# Altium schematic sheet LED Connectors.SchDoc
size A4
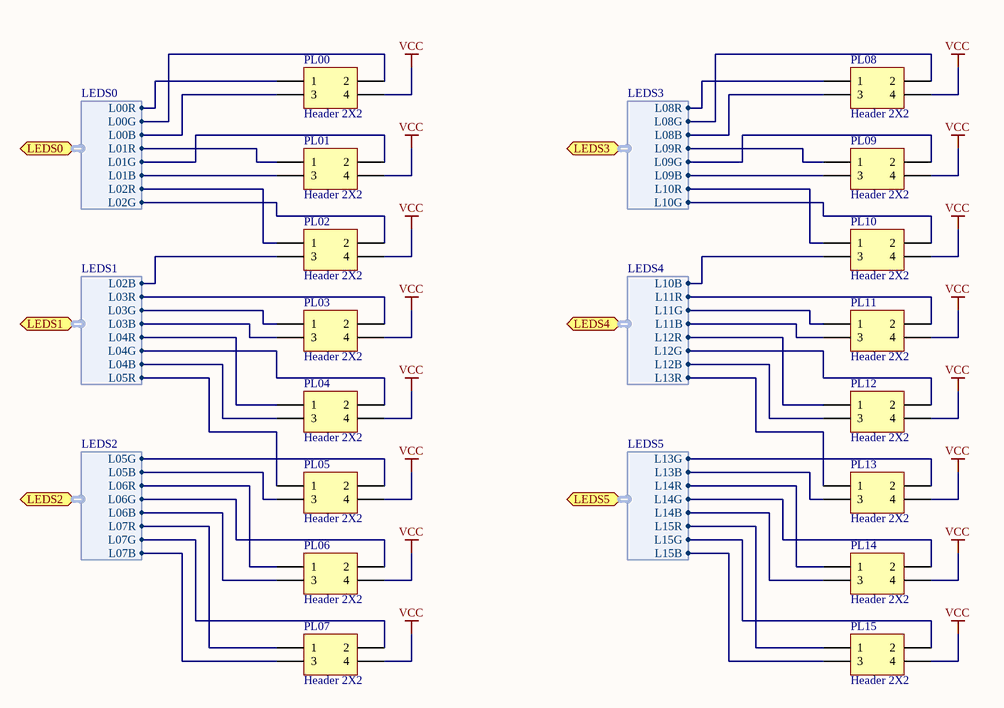
[diagram p0: LED Connectors.SchDoc]

## Parts
PL00  Header 2X2  [HDR2X2]
PL01  Header 2X2  [HDR2X2]
PL02  Header 2X2  [HDR2X2]
PL03  Header 2X2  [HDR2X2]
PL04  Header 2X2  [HDR2X2]
PL05  Header 2X2  [HDR2X2]
PL06  Header 2X2  [HDR2X2]
PL07  Header 2X2  [HDR2X2]
PL08  Header 2X2  [HDR2X2]
PL09  Header 2X2  [HDR2X2]
PL10  Header 2X2  [HDR2X2]
PL11  Header 2X2  [HDR2X2]
PL12  Header 2X2  [HDR2X2]
PL13  Header 2X2  [HDR2X2]
PL14  Header 2X2  [HDR2X2]
PL15  Header 2X2  [HDR2X2]

## Ports
LEDS0 (harness LEDS0), LEDS1 (harness LEDS1), LEDS2 (harness LEDS2), LEDS3 (harness LEDS3), LEDS4 (harness LEDS4), LEDS5 (harness LEDS5)

## Harnesses
LEDS0: L02G, L02R, L01B, L01G, L01R, L00B, L00G, L00R
LEDS1: L05R, L04B, L04G, L04R, L03B, L03G, L03R, L02B
LEDS2: L07B, L07G, L07R, L06B, L06G, L06R, L05B, L05G
LEDS3: L10G, L10R, L09B, L09G, L09R, L08B, L08G, L08R
LEDS4: L13R, L12B, L12G, L12R, L11B, L11G, L11R, L10B
LEDS5: L15B, L15G, L15R, L14B, L14G, L14R, L13B, L13G

## Nets
VCC: PL00.4 PL01.4 PL02.4 PL03.4 PL04.4 PL05.4 PL06.4 PL07.4 PL08.4 PL09.4 PL10.4 PL11.4 PL12.4 PL13.4 PL14.4 PL15.4
NetPL00_1: PL00.1 ; port LEDS0.L00R
NetPL00_2: PL00.2 ; port LEDS0.L00G
NetPL00_3: PL00.3 ; port LEDS0.L00B
NetPL01_1: PL01.1 ; port LEDS0.L01R
NetPL01_2: PL01.2 ; port LEDS0.L01G
NetPL01_3: PL01.3 ; port LEDS0.L01B
NetPL02_1: PL02.1 ; port LEDS0.L02R
NetPL02_2: PL02.2 ; port LEDS0.L02G
NetPL02_3: PL02.3 ; port LEDS1.L02B
NetPL03_1: PL03.1 ; port LEDS1.L03G
NetPL03_2: PL03.2 ; port LEDS1.L03R
NetPL03_3: PL03.3 ; port LEDS1.L03B
NetPL04_1: PL04.1 ; port LEDS1.L04R
NetPL04_2: PL04.2 ; port LEDS1.L04G
NetPL04_3: PL04.3 ; port LEDS1.L04B
NetPL05_1: PL05.1 ; port LEDS1.L05R
NetPL05_2: PL05.2 ; port LEDS2.L05G
NetPL05_3: PL05.3 ; port LEDS2.L05B
NetPL06_1: PL06.1 ; port LEDS2.L06R
NetPL06_2: PL06.2 ; port LEDS2.L06G
NetPL06_3: PL06.3 ; port LEDS2.L06B
NetPL07_1: PL07.1 ; port LEDS2.L07R
NetPL07_2: PL07.2 ; port LEDS2.L07G
NetPL07_3: PL07.3 ; port LEDS2.L07B
NetPL08_1: PL08.1 ; port LEDS3.L08R
NetPL08_2: PL08.2 ; port LEDS3.L08G
NetPL08_3: PL08.3 ; port LEDS3.L08B
NetPL09_1: PL09.1 ; port LEDS3.L09R
NetPL09_2: PL09.2 ; port LEDS3.L09G
NetPL09_3: PL09.3 ; port LEDS3.L09B
NetPL10_1: PL10.1 ; port LEDS3.L10R
NetPL10_2: PL10.2 ; port LEDS3.L10G
NetPL10_3: PL10.3 ; port LEDS4.L10B
NetPL11_1: PL11.1 ; port LEDS4.L11G
NetPL11_2: PL11.2 ; port LEDS4.L11R
NetPL11_3: PL11.3 ; port LEDS4.L11B
NetPL12_1: PL12.1 ; port LEDS4.L12R
NetPL12_2: PL12.2 ; port LEDS4.L12G
NetPL12_3: PL12.3 ; port LEDS4.L12B
NetPL13_1: PL13.1 ; port LEDS4.L13R
NetPL13_2: PL13.2 ; port LEDS5.L13G
NetPL13_3: PL13.3 ; port LEDS5.L13B
NetPL14_1: PL14.1 ; port LEDS5.L14R
NetPL14_2: PL14.2 ; port LEDS5.L14G
NetPL14_3: PL14.3 ; port LEDS5.L14B
NetPL15_1: PL15.1 ; port LEDS5.L15R
NetPL15_2: PL15.2 ; port LEDS5.L15G
NetPL15_3: PL15.3 ; port LEDS5.L15B

## Library data of the parts
PL00 PL01 PL02 PL03 PL04 PL05 PL06 PL07 PL08 PL09-PL15 = Header 2X2: Header, 2-Pin, Dual row; LatestRevisionDate: 17-Jul-2002; LatestRevisionNote: Re-released for DXP Platform.; Publisher: Altium Limited